# EAGLE design Son_of_Dark_Powersch (EAGLE 7.3.0)

## Sheet 1 of 5
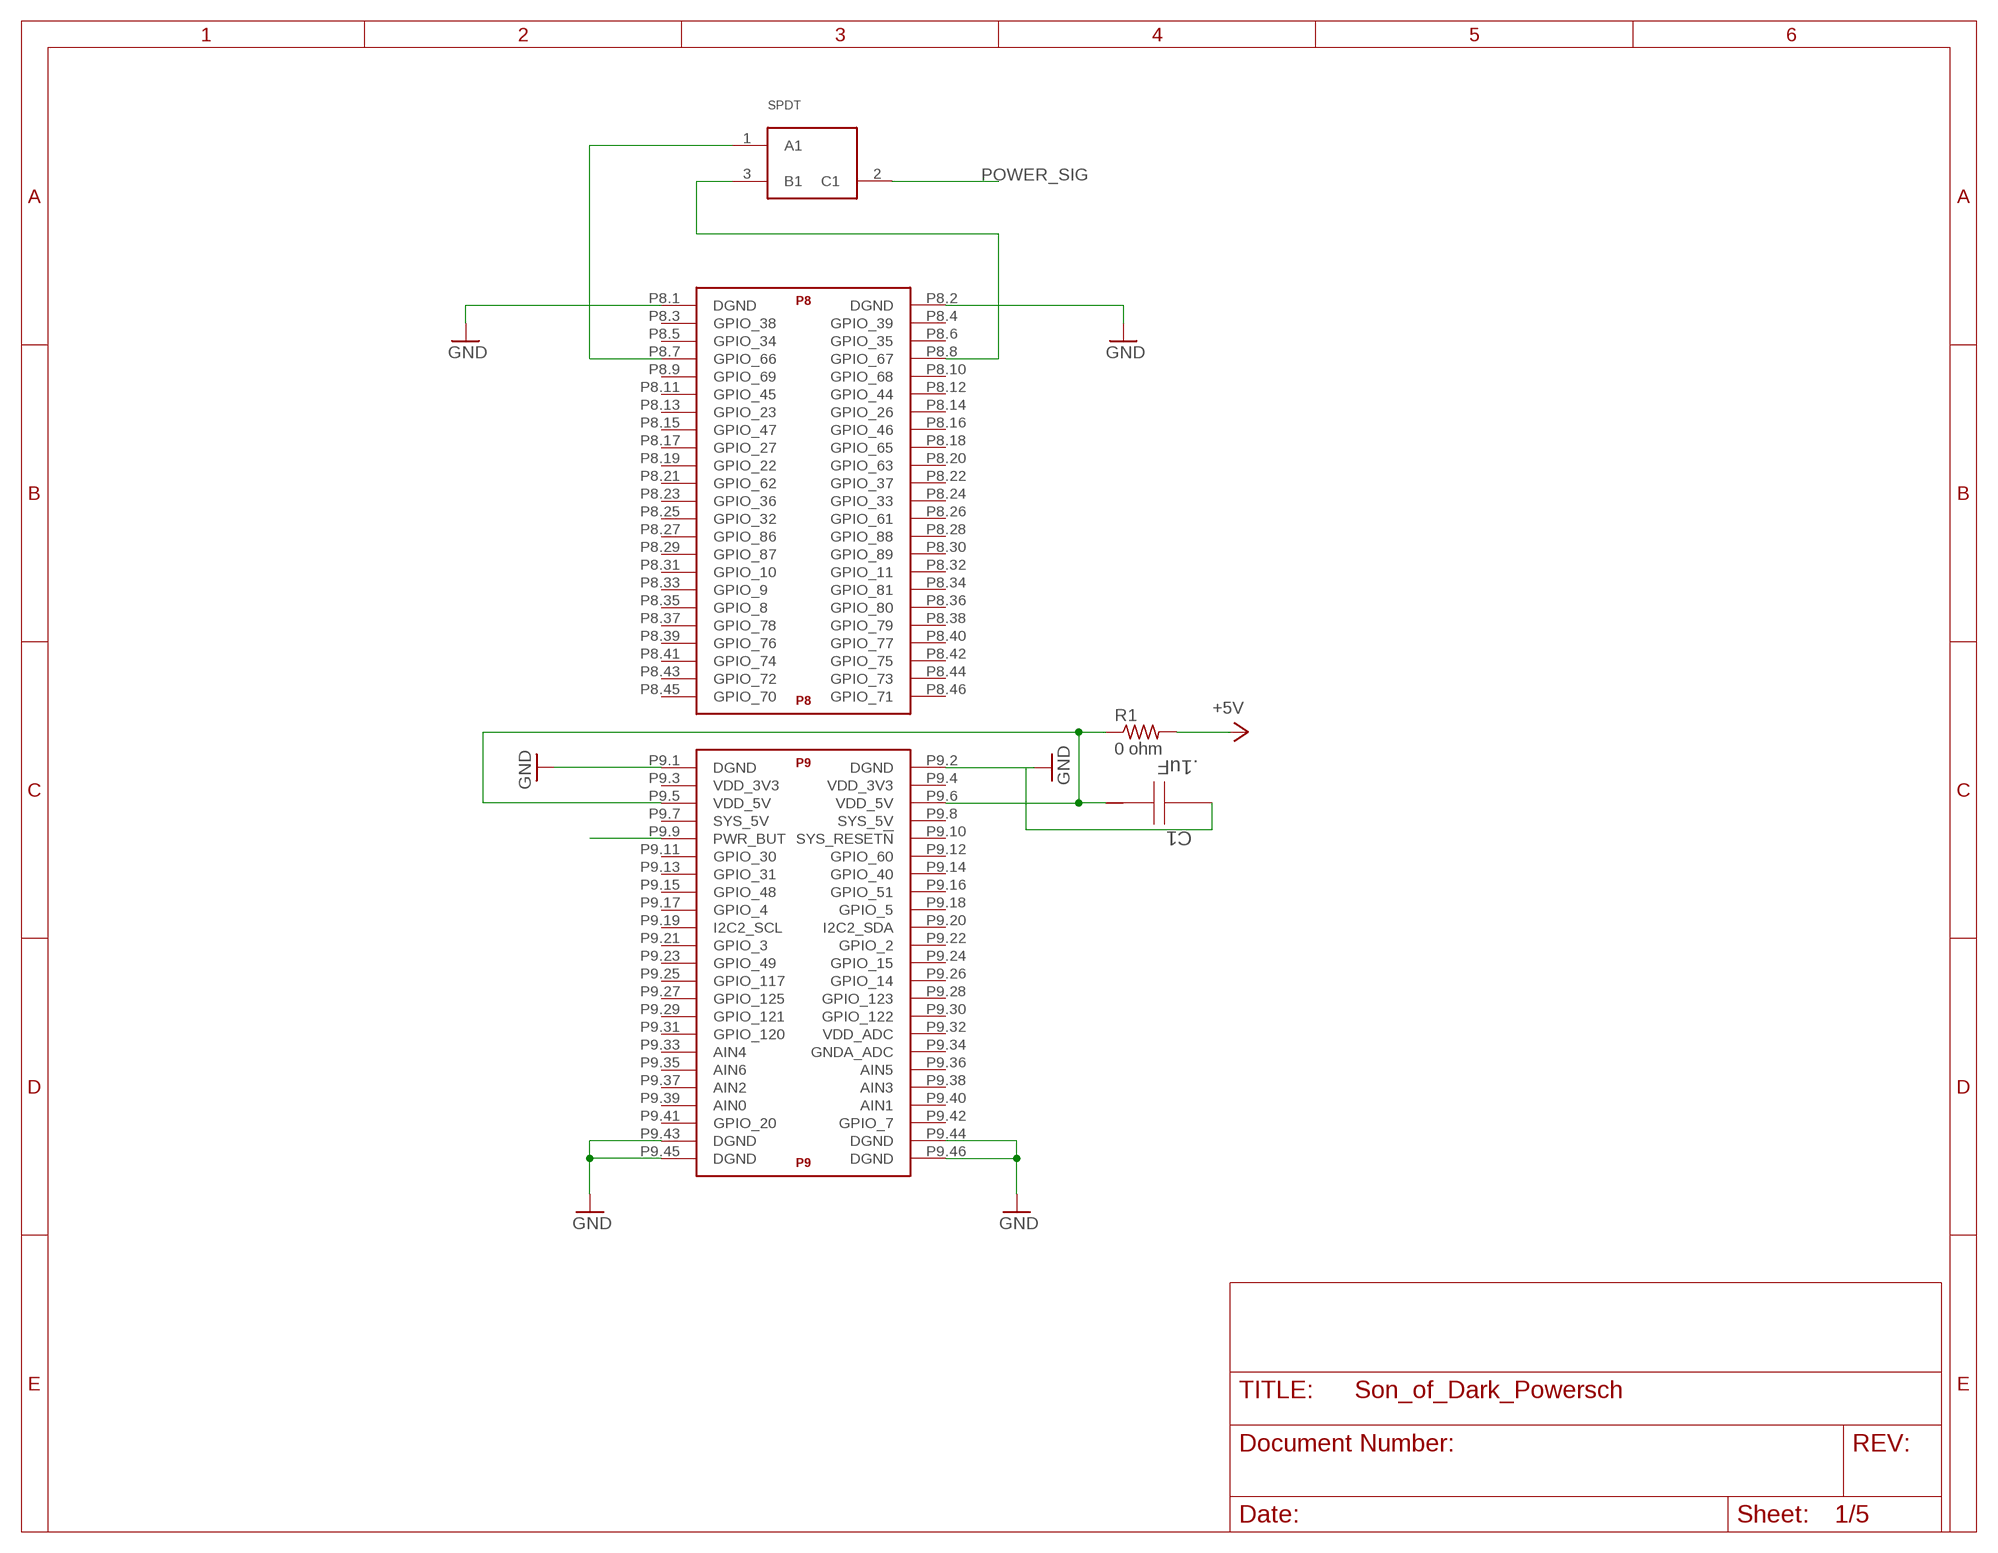
[diagram p0: schematic, sheet 1]

### Parts
C1  .1uF  C3216X5R1A106K  [1206]
R1  0 ohm  R-US_R1206  [R1206]
SPDT  SPDT_SWITCH  [SPDT]
U$1  BEAGLE_BONE_BLACK_CAPE  [BEAGLE_BONE_BLACK_CAPE]

### Nets
+5V: R1.2 ; also sheet 2,5
BB_PWR_SW: U$1.P9.9(P9:PWR_BUT) ; also sheet 5
GND: C1.2 U$1.P8.1(P8:DGND) U$1.P8.2(P8:DGND) U$1.P9.1(P9:DGND) U$1.P9.2(P9:DGND) U$1.P9.43(P9:DGND) U$1.P9.44(P9:DGND) U$1.P9.45(P9:DGND) U$1.P9.46(P9:DGND) ; also sheet 2,3,4,5
N$1: C1.1 R1.1 U$1.P9.5(P9:VDD_5V) U$1.P9.6(P9:VDD_5V)
N$12: SPDT.1(A1) U$1.P8.7(P8:GPIO_66)
N$13: SPDT.3(B1) U$1.P8.8(P8:GPIO_67)
POWER_SIG: SPDT.2(C1) ; also sheet 5
Unconnected: U$1.P8.3(P8:GPIO_38) U$1.P8.4(P8:GPIO_39) U$1.P8.5(P8:GPIO_34) U$1.P8.6(P8:GPIO_35) U$1.P8.9(P8:GPIO_69) U$1.P8.10(P8:GPIO_68) U$1.P8.11(P8:GPIO_45) U$1.P8.12(P8:GPIO_44) U$1.P8.13(P8:GPIO_23) U$1.P8.14(P8:GPIO_26) U$1.P8.15(P8:GPIO_47) U$1.P8.16(P8:GPIO_46) U$1.P8.17(P8:GPIO_27) U$1.P8.18(P8:GPIO_65) U$1.P8.19(P8:GPIO_22) U$1.P8.20(P8:GPIO_63) U$1.P8.21(P8:GPIO_62) U$1.P8.22(P8:GPIO_37) U$1.P8.23(P8:GPIO_36) U$1.P8.24(P8:GPIO_33) U$1.P8.25(P8:GPIO_32) U$1.P8.26(P8:GPIO_61) U$1.P8.27(P8:GPIO_86) U$1.P8.28(P8:GPIO_88) U$1.P8.29(P8:GPIO_87) U$1.P8.30(P8:GPIO_89) U$1.P8.31(P8:GPIO_10) U$1.P8.32(P8:GPIO_11) U$1.P8.33(P8:GPIO_9) U$1.P8.34(P8:GPIO_81) U$1.P8.35(P8:GPIO_8) U$1.P8.36(P8:GPIO_80) U$1.P8.37(P8:GPIO_78) U$1.P8.38(P8:GPIO_79) U$1.P8.39(P8:GPIO_76) U$1.P8.40(P8:GPIO_77) U$1.P8.41(P8:GPIO_74) U$1.P8.42(P8:GPIO_75) U$1.P8.43(P8:GPIO_72) U$1.P8.44(P8:GPIO_73) U$1.P8.45(P8:GPIO_70) U$1.P8.46(P8:GPIO_71) U$1.P9.3(P9:VDD_3V3) U$1.P9.4(P9:VDD_3V3) U$1.P9.7(P9:SYS_5V) U$1.P9.8(P9:SYS_5V) U$1.P9.10(P9:SYS_RESET!N) U$1.P9.11(P9:GPIO_30) U$1.P9.12(P9:GPIO_60) U$1.P9.13(P9:GPIO_31) U$1.P9.14(P9:GPIO_40) U$1.P9.15(P9:GPIO_48) U$1.P9.16(P9:GPIO_51) U$1.P9.17(P9:GPIO_4) U$1.P9.18(P9:GPIO_5) U$1.P9.19(P9:I2C2_SCL) U$1.P9.20(P9:I2C2_SDA) U$1.P9.21(P9:GPIO_3) U$1.P9.22(P9:GPIO_2) U$1.P9.23(P9:GPIO_49) U$1.P9.24(P9:GPIO_15) U$1.P9.25(P9:GPIO_117) U$1.P9.26(P9:GPIO_14) U$1.P9.27(P9:GPIO_125) U$1.P9.28(P9:GPIO_123) U$1.P9.29(P9:GPIO_121) U$1.P9.30(P9:GPIO_122) U$1.P9.31(P9:GPIO_120) U$1.P9.32(P9:VDD_ADC) U$1.P9.33(P9:AIN4) U$1.P9.34(P9:GNDA_ADC) U$1.P9.35(P9:AIN6) U$1.P9.36(P9:AIN5) U$1.P9.37(P9:AIN2) U$1.P9.38(P9:AIN3) U$1.P9.39(P9:AIN0) U$1.P9.40(P9:AIN1) U$1.P9.41(P9:GPIO_20) U$1.P9.42(P9:GPIO_7)

## Sheet 2 of 5
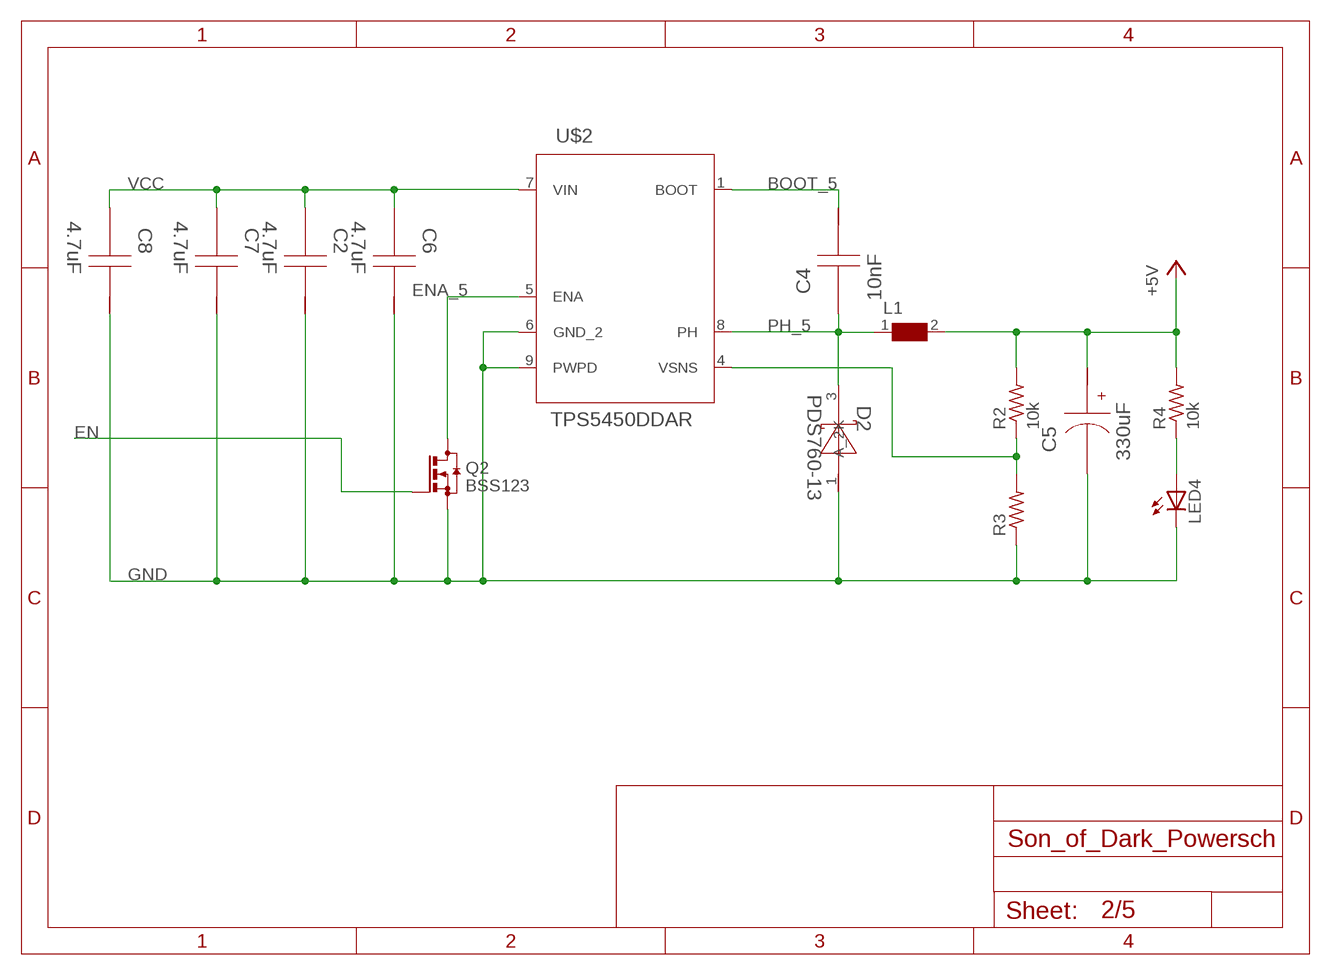
[diagram p1: schematic, sheet 2]

### Parts
C2  4.7uF  GRM31CR71H475KA12L  [1206]
C4  10nF  C0805C103K5RACTU  [0805]
C5  330uF  10SVP330MX  [SM_RADIAL_10AMM]
C6  4.7uF  GRM31CR71H475KA12L  [1206]
C7  4.7uF  GRM31CR71H475KA12L  [1206]
C8  4.7uF  GRM31CR71H475KA12L  [1206]
D2  PDS760-13  [POWERDI5]
L1  WE-HCC-7443331000_1090  [WE-HCC_1090]
LED4  LEDSML1206  [SML1206]
Q2  BSS123  [SOT23]
R2  10k  R-US_R1206  [R1206]
R3  R-US_R1206  [R1206]
R4  10k  R-US_R1206  [R1206]
U$2  TPS5450DDAR  [R-PDSO-G8]

### Nets
+5V: C5.1(+) L1.2 R2.2 R4.2 ; also sheet 1,5
BOOT_5: C4.1 U$2.1(BOOT)
EN: Q2.1(G) ; also sheet 3,4,5
ENA_5: Q2.3(D) U$2.5(ENA)
GND: C2.1 C5.2(-) C6.1 C7.1 C8.1 D2.1(A_2) LED4.C Q2.2(S) R3.1 U$2.6(GND_2) U$2.9(PWPD) ; also sheet 1,3,4,5
N$2: LED4.A R4.1
PH_5: C4.2 D2.3(K) L1.1 U$2.8(PH)
VCC: C2.2 C6.2 C7.2 C8.2 U$2.7(VIN) ; also sheet 3,4,5
VSNS_5: R2.1 R3.2 U$2.4(VSNS)

## Sheet 3 of 5
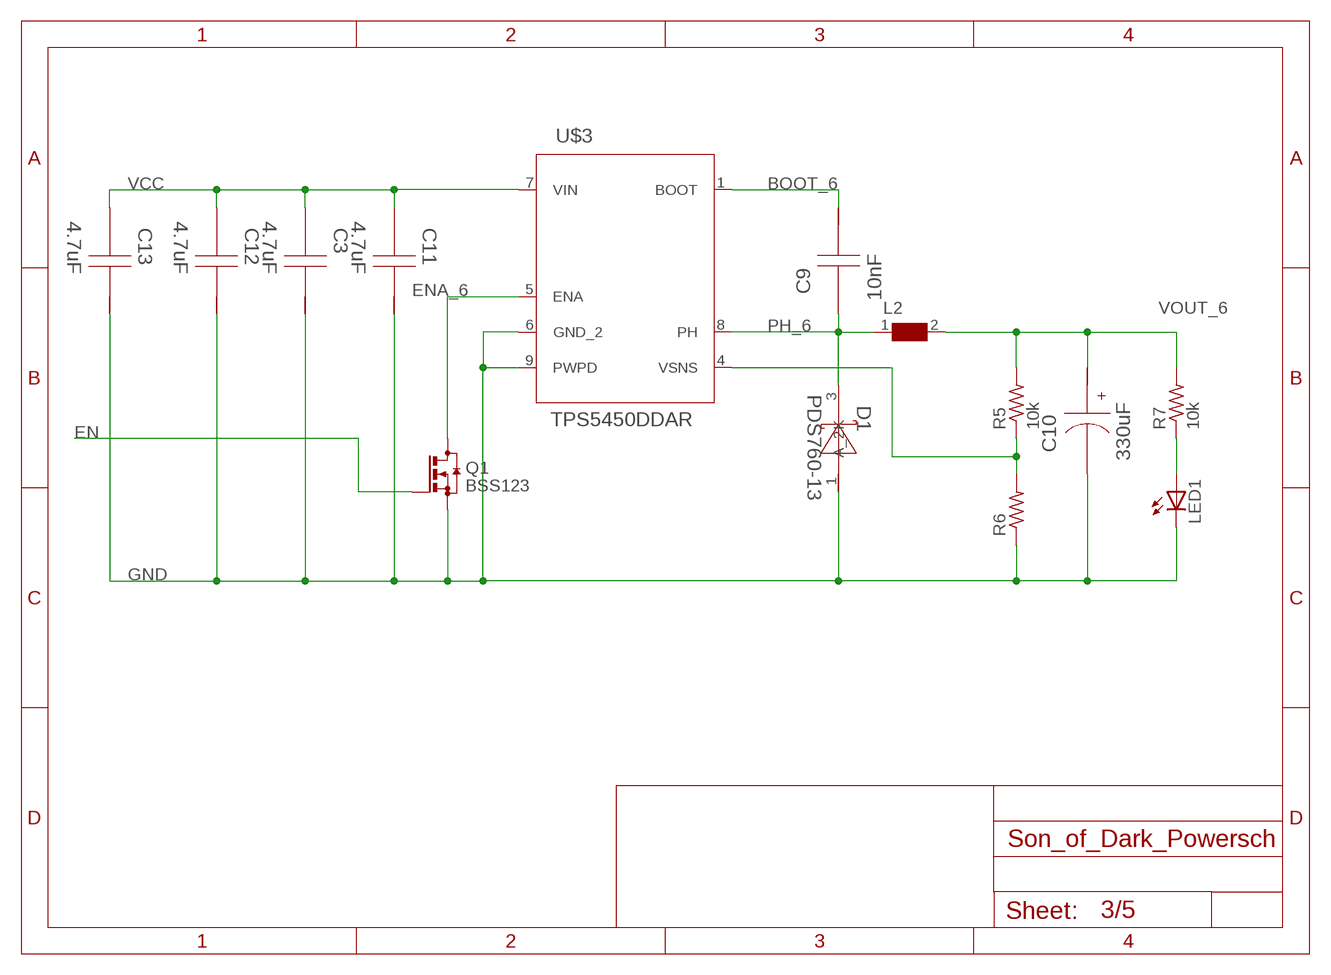
[diagram p2: schematic, sheet 3]

### Parts
C3  4.7uF  GRM31CR71H475KA12L  [1206]
C9  10nF  C0805C103K5RACTU  [0805]
C10  330uF  10SVP330MX  [SM_RADIAL_10AMM]
C11  4.7uF  GRM31CR71H475KA12L  [1206]
C12  4.7uF  GRM31CR71H475KA12L  [1206]
C13  4.7uF  GRM31CR71H475KA12L  [1206]
D1  PDS760-13  [POWERDI5]
L2  WE-HCC-7443331000_1090  [WE-HCC_1090]
LED1  LEDSML1206  [SML1206]
Q1  BSS123  [SOT23]
R5  10k  R-US_R1206  [R1206]
R6  R-US_R1206  [R1206]
R7  10k  R-US_R1206  [R1206]
U$3  TPS5450DDAR  [R-PDSO-G8]

### Nets
BOOT_6: C9.1 U$3.1(BOOT)
EN: Q1.1(G) ; also sheet 2,4,5
ENA_6: Q1.3(D) U$3.5(ENA)
GND: C3.1 C10.2(-) C11.1 C12.1 C13.1 D1.1(A_2) LED1.C Q1.2(S) R6.1 U$3.6(GND_2) U$3.9(PWPD) ; also sheet 1,2,4,5
N$3: LED1.A R7.1
PH_6: C9.2 D1.3(K) L2.1 U$3.8(PH)
VCC: C3.2 C11.2 C12.2 C13.2 U$3.7(VIN) ; also sheet 2,4,5
VOUT_6: C10.1(+) L2.2 R5.2 R7.2 ; also sheet 5
VSNS_6: R5.1 R6.2 U$3.4(VSNS)

## Sheet 4 of 5
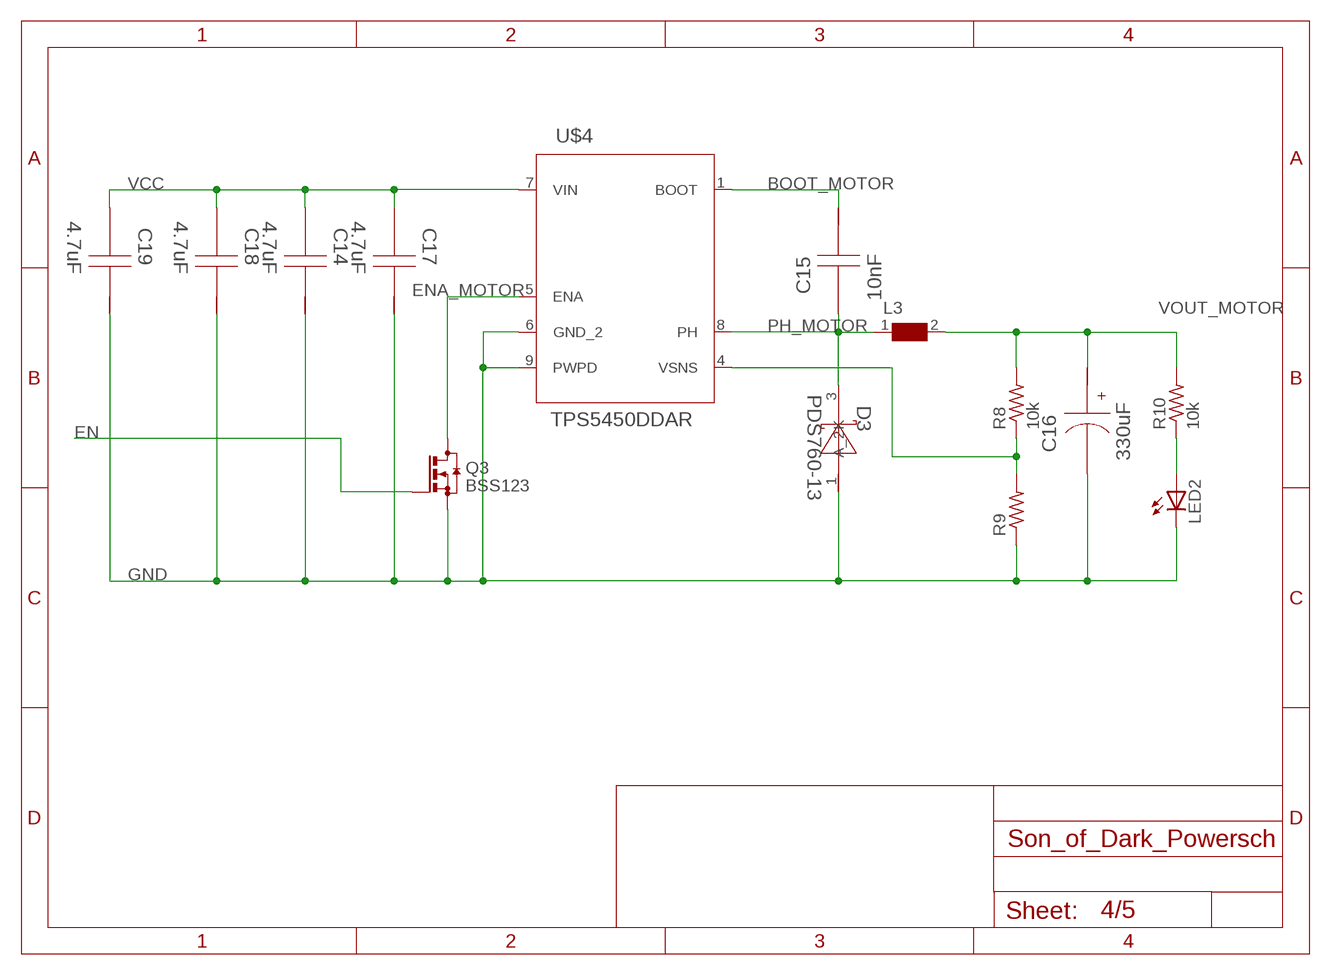
[diagram p3: schematic, sheet 4]

### Parts
C14  4.7uF  GRM31CR71H475KA12L  [1206]
C15  10nF  C0805C103K5RACTU  [0805]
C16  330uF  10SVP330MX  [SM_RADIAL_10AMM]
C17  4.7uF  GRM31CR71H475KA12L  [1206]
C18  4.7uF  GRM31CR71H475KA12L  [1206]
C19  4.7uF  GRM31CR71H475KA12L  [1206]
D3  PDS760-13  [POWERDI5]
L3  WE-HCC-7443331000_1090  [WE-HCC_1090]
LED2  LEDSML1206  [SML1206]
Q3  BSS123  [SOT23]
R8  10k  R-US_R1206  [R1206]
R9  R-US_R1206  [R1206]
R10  10k  R-US_R1206  [R1206]
U$4  TPS5450DDAR  [R-PDSO-G8]

### Nets
BOOT_MOTOR: C15.1 U$4.1(BOOT)
EN: Q3.1(G) ; also sheet 2,3,5
ENA_MOTOR: Q3.3(D) U$4.5(ENA)
GND: C14.1 C16.2(-) C17.1 C18.1 C19.1 D3.1(A_2) LED2.C Q3.2(S) R9.1 U$4.6(GND_2) U$4.9(PWPD) ; also sheet 1,2,3,5
N$4: LED2.A R10.1
PH_MOTOR: C15.2 D3.3(K) L3.1 U$4.8(PH)
VCC: C14.2 C17.2 C18.2 C19.2 U$4.7(VIN) ; also sheet 2,3,5
VOUT_MOTOR: C16.1(+) L3.2 R8.2 R10.2 ; also sheet 5
VSNS1_MOTOR: R8.1 R9.2 U$4.4(VSNS)

## Sheet 5 of 5
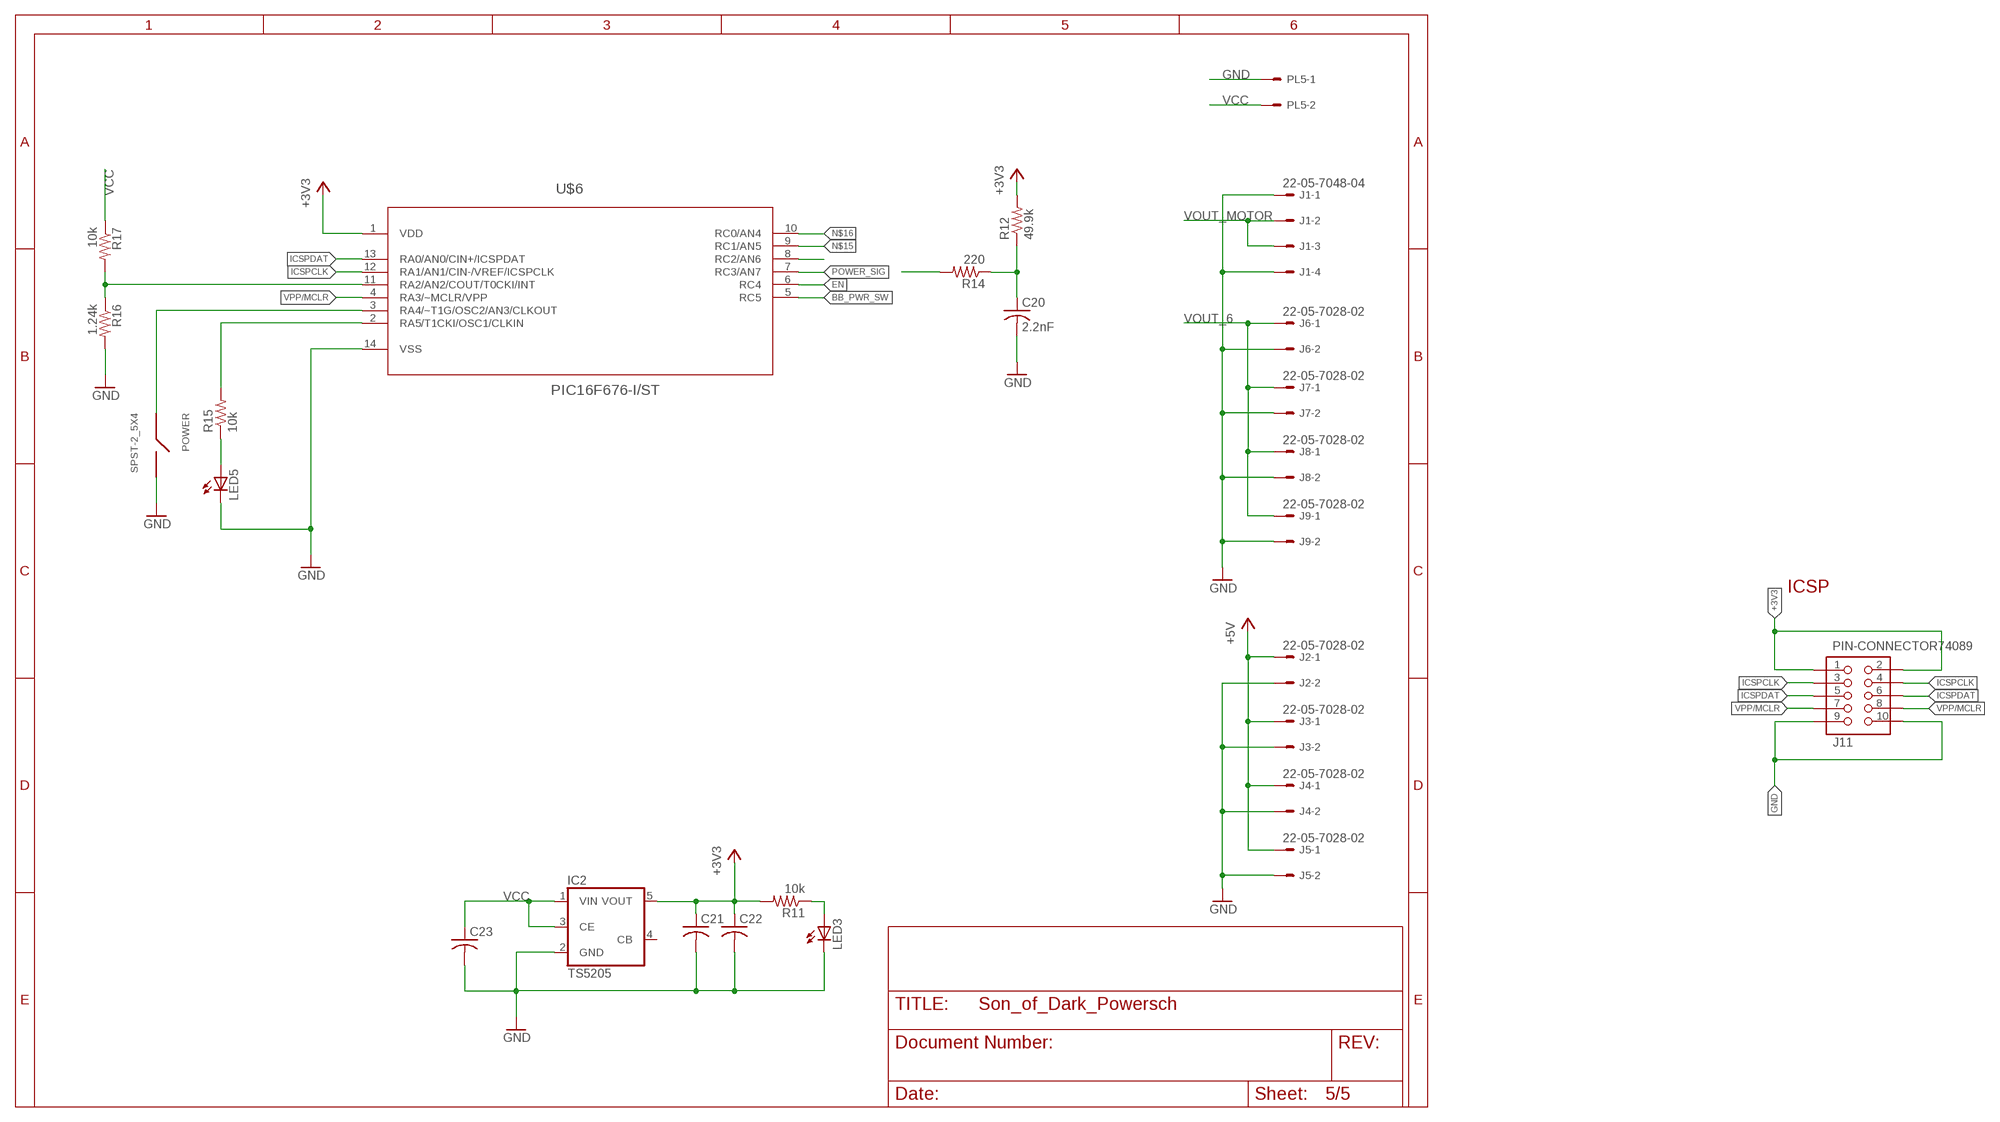
[diagram p4: schematic, sheet 5]

### Parts
C20  2.2nF  C-USC0603  [C0603]
C21  C-USC0603  [C0603]
C22  C-USC0603  [C0603]
C23  C-USC0603  [C0603]
IC2  TS5205  [SOT25]
J1  22-05-7048-04  [7395-04]
J2  22-05-7028-02  [7395-02]
J3  22-05-7028-02  [7395-02]
J4  22-05-7028-02  [7395-02]
J5  22-05-7028-02  [7395-02]
J6  22-05-7028-02  [7395-02]
J7  22-05-7028-02  [7395-02]
J8  22-05-7028-02  [7395-02]
J9  22-05-7028-02  [7395-02]
J11  PIN-CONNECTOR74089  [10-PIN-SMD]
LED3  LEDSML1206  [SML1206]
LED5  LEDSML1206  [SML1206]
PL5  555X-2H  [5569-2]
POWER  SPST-2_5X4  [SPST-TAC-4X2_5MM]
R11  10k  R-US_R1206  [R1206]
R12  49.9k  R-US_R0603  [R0603]
R14  220  R-US_R0603  [R0603]
R15  10k  R-US_R1206  [R1206]
R16  1.24k  R-US_R0603  [R0603]
R17  10k  R-US_R0603  [R0603]
U$6  PIC16F676-I/ST  [SOP65P640X120-14N]

### Nets
+3V3: C21.1 C22.1 IC2.5(VOUT) J11.1 J11.2 R11.2 R12.2 U$6.1(VDD)
+5V: J2.1 J3.1 J4.1 J5.1 ; also sheet 1,2
BB_PWR_SW: U$6.5(RC5) ; also sheet 1
EN: U$6.6(RC4) ; also sheet 2,3,4
GND: C20.2 C21.2 C22.2 C23.2 IC2.2(GND) J1.1 J1.4 J2.2 J3.2 J4.2 J5.2 J6.2 J7.2 J8.2 J9.2 J11.9 J11.10 LED3.C LED5.C PL5.1 POWER.P$2 R16.2 U$6.14(VSS) ; also sheet 1,2,3,4
ICSPCLK: J11.3 J11.4 U$6.12(RA1/AN1/CIN-/VREF/ICSPCLK)
ICSPDAT: J11.5 J11.6 U$6.13(RA0/AN0/CIN+/ICSPDAT)
N$5: U$6.8(RC2/AN6)
N$6: C20.1 R12.1 R14.1
N$7: LED3.A R11.1
N$8: R16.1 R17.2 U$6.11(RA2/AN2/COUT/T0CKI/INT)
N$9: R15.2 U$6.2(RA5/T1CKI/OSC1/CLKIN)
N$10: LED5.A R15.1
N$11: POWER.P$1 U$6.3(RA4/~T1G/OSC2/AN3/CLKOUT)
N$15: U$6.9(RC1/AN5)
N$16: U$6.10(RC0/AN4)
POWER_SIG: U$6.7(RC3/AN7) ; also sheet 1
VCC: C23.1 IC2.1(VIN) IC2.3(CE) PL5.2 R17.1 ; also sheet 2,3,4
VOUT_6: J6.1 J7.1 J8.1 J9.1 ; also sheet 3
VOUT_MOTOR: J1.2 J1.3 ; also sheet 4
VPP/MCLR: J11.7 J11.8 R14.2 U$6.4(RA3/~MCLR/VPP)
Unconnected: IC2.4(CB)

### Notes on the sheet
- ICSP

## Library data of the parts
C1 = 3-3_fixed:C3216X5R1A106K; CAP: 1.0E-5; DATASHEETURL: http://www.tdk.co.jp/tefe02/e3999%5Fc.pdf; ESR: 0.00306; IRMS: 0.0; MANUFACTURER_PART_NUMBER: C3216X5R1A106K; VDC: 10.0; VENDOR: TDK
C2 C3 C6-C8 C11-C14 C17-C19 = 5v:GRM31CR71H475KA12L; CAP: 4.7E-6; ESR: 0.0; IRMS: 0.0; MANUFACTURER_NAME: MuRata; MANUFACTURER_PART_NUMBER: GRM31CR71H475KA12L; VDC: 50.0; VENDOR: MuRata
C4 C9 C15 = 5v:C0805C103K5RACTU; CAP: 1.0E-8; ESR: 1.739; IRMS: 0.411; MANUFACTURER_NAME: Kemet; MANUFACTURER_PART_NUMBER: C0805C103K5RACTU; VDC: 50.0; VENDOR: Kemet
C5 C10 C16 = 5v:10SVP330MX; CAP: 3.3E-4; DATASHEETURL: http://www.edc.sanyo.com/english/pdf/oscon/E32.pdf; ESR: 0.025; IRMS: 3.7; MANUFACTURER_NAME: Panasonic; MANUFACTURER_PART_NUMBER: 10SVP330MX; VDC: 10.0; VENDOR: Panasonic
C20-C23 = rcl:C-US: CAPACITOR, American symbol
D1-D3 = 5v:PDS760-13; DATASHEETURL: www.diodes.com/datasheets/ds30477.pdf; IO: 7.0; MANUFACTURER_NAME: Diodes Inc.; MANUFACTURER_PART_NUMBER: PDS760-13; VENDOR: Diodes Inc.; VFATIO: 0.56; VRRM: 60.0
IC2 = v-reg:TS5205: 150mA Low Noise LDO Voltage Regulator with Enable TSC [Taiwan Semiconductor Company, Ltd] Source: http://www.taiwansemi.com .. 5205_0409c.pdf
J1 = con-molex:22-?-04: CONNECTOR wire to board 2.54 mm (.1 inch) pitch header; OC_FARNELL: unknown; OC_NEWARK: unknown
J2-J9 = con-molex:22-?-02: CONNECTOR wire to board 2.54 mm (.1 inch) pitch header; OC_FARNELL: 9731601; OC_NEWARK: unknown
J11 = Mother-Board-rev5:PIN-CONNECTOR
L1-L3 = WE-HCC:WE-HCC: SMD High Current Cube Inductor WE-HCC - magnetically shieled - current capability up to 27A - excellent saturation characteristics -- filter choke for DC/DC converter -- single and polyphase buck converter -- filter choke for motor electronics; MPN: 7443331000; OC_FARNELL: 1848254; OC_NEWARK: 13T9771; PACKAGE: 1090; SUPPLIER: Wuerth Elektronik
LED1-LED5 = led:LED: LED OSRAM: - CHIPLED LG R971, LG N971, LY N971, LG Q971, LY Q971, LO R971, LY R971 LH N974, LH R974 LS Q976, LO Q976, LY Q976 LO Q996 - Hyper CHIPLED LW Q18S LB Q993, LB Q99A, LB R99A - SideLED LS A670, LO A670, LY A670, LG A670, LP A670 LB A673, LV A673, LT A673, LW A673 LH A674 LY A675 LS A676, LA A676, LO A676, LY A676, LW A676 LS A679, LY A679, LG A679 - Hyper Micro SIDELED® LS Y876, LA Y876, LO Y876, LY Y876 LT Y87S - SmartLED LW L88C, LW L88S LB L89C, LB L89S, LG L890 LS L89K, LO L89K, LY L89K LS L896, LA L896, LO L896, LY L896 - TOPLED LS T670, LO T670, LY T670, LG T670, LP T670 LSG T670, LSP T670, LSY T670, LOP T670, LYG T670 LG T671, LOG T671, LSG T671 LB T673, LV T673, LT T673, LW T673 LH T674 LS T676, LA T676, LO T676, LY T676, LB T676, LH T676, LSB T676, LW T676 LB T67C, LV T67C, LT T67C, LS T67K, LO T67K, LY T67K, LW E67C LS E67B, LA E67B, LO E67B, LY E67B, LB E67C, LV E67C, LT E67C LW T67C LS T679, LY T679, LG T679 LS T770, LO T770, LY T770, LG T770, LP T770 LB T773, LV T773, LT T773, LW T773 LH T774 LS E675, LA E675, LY E675, LS T675 LS T776, LA T776, LO T776, LY T776, LB T776 LHGB T686 LT T68C, LB T68C - Hyper Mini TOPLED® LB M676 - Mini TOPLED Santana® LG M470 LS M47K, LO M47K, LY M47K Source: http://www.osram.convergy.de LUXEON: - LUMILED® LXK2-PW12-R00, LXK2-PW12-S00, LXK2-PW14-U00, LXK2-PW14-V00 LXK2-PM12-R00, LXK2-PM12-S00, LXK2-PM14-U00 LXK2-PE12-Q00, LXK2-PE12-R00, LXK2-PE12-S00, LXK2-PE14-T00, LXK2-PE14-U00 LXK2-PB12-K00, LXK2-PB12-L00, LXK2-PB12-M00, LXK2-PB14-N00, LXK2-PB14-P00, LXK2-PB14-Q00 LXK2-PR12-L00, LXK2-PR12-M00, LXK2-PR14-Q00, LXK2-PR14-R00 LXK2-PD12-Q00, LXK2-PD12-R00, LXK2-PD12-S00 LXK2-PH12-R00, LXK2-PH12-S00 LXK2-PL12-P00, LXK2-PL12-Q00, LXK2-PL12-R00 Source: www.luxeon.com KINGBRIGHT: KA-3528ASYC Source: www.kingbright.com
PL5 = con-molex-2:555X-2: Mini FIT connector 2 way
POWER = ultrasonic_mount:SPST-2_5X4
Q1-Q3 = transistor-small-signal:BSS123: N-CHANNEL MOS FET
R1-R12 R14-R17 = rcl:R-US_: RESISTOR, American symbol
SPDT = range_cape:SPDT_SWITCH
U$1 = SparkFun-Boards:BEAGLE_BONE_BLACK_CAPE
U$2-U$4 = 5v:TPS5450DDAR; DATASHEETURL: http://www.ti.com/product/tps5450; FREQUENCY: 500000.0; IMAX: 5.0; MANUFACTURER_NAME: Texas Instruments; MANUFACTURER_PART_NUMBER: TPS5450DDA; MKTG_PACKAGE: TPS5450; NSID: TPS5450DDAR; PACKAGE: TPS5450; VENDOR: Texas Instruments
U$6 = Microchip_By_element14_Batch_1:PIC16F676-I/ST: 8 bit CMOS Microcontrollers; DESCRIPTION: 8 bit CMOS Microcontrollers; MPN: PIC16F676-I/ST; OC_FARNELL: 9760539; OC_NEWARK: 92C4553; PACKAGE: TSSOP-14; SUPPLIER: Microchip

## Board
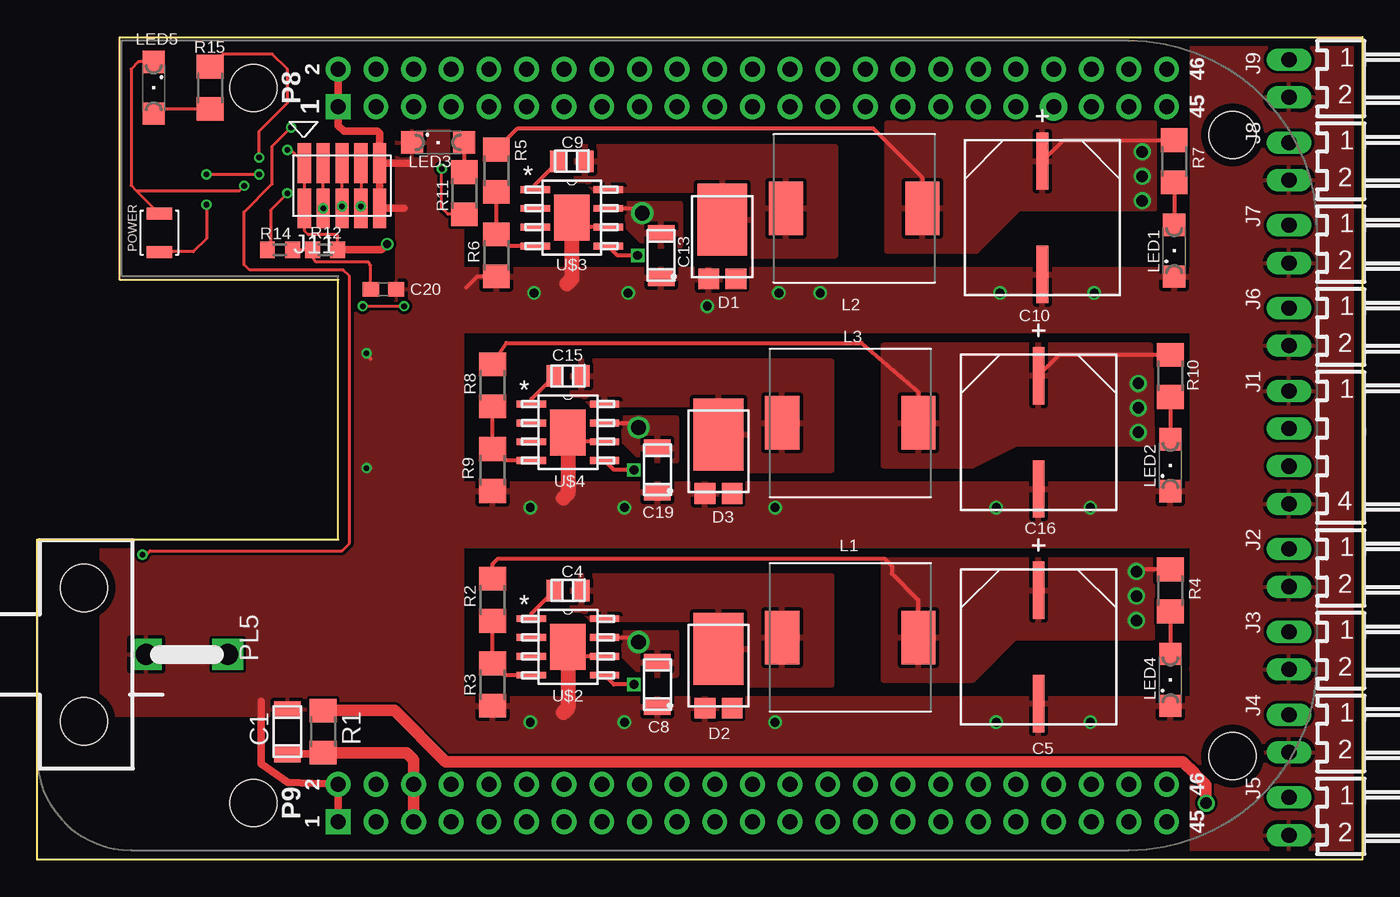
[diagram p5: board, top side]
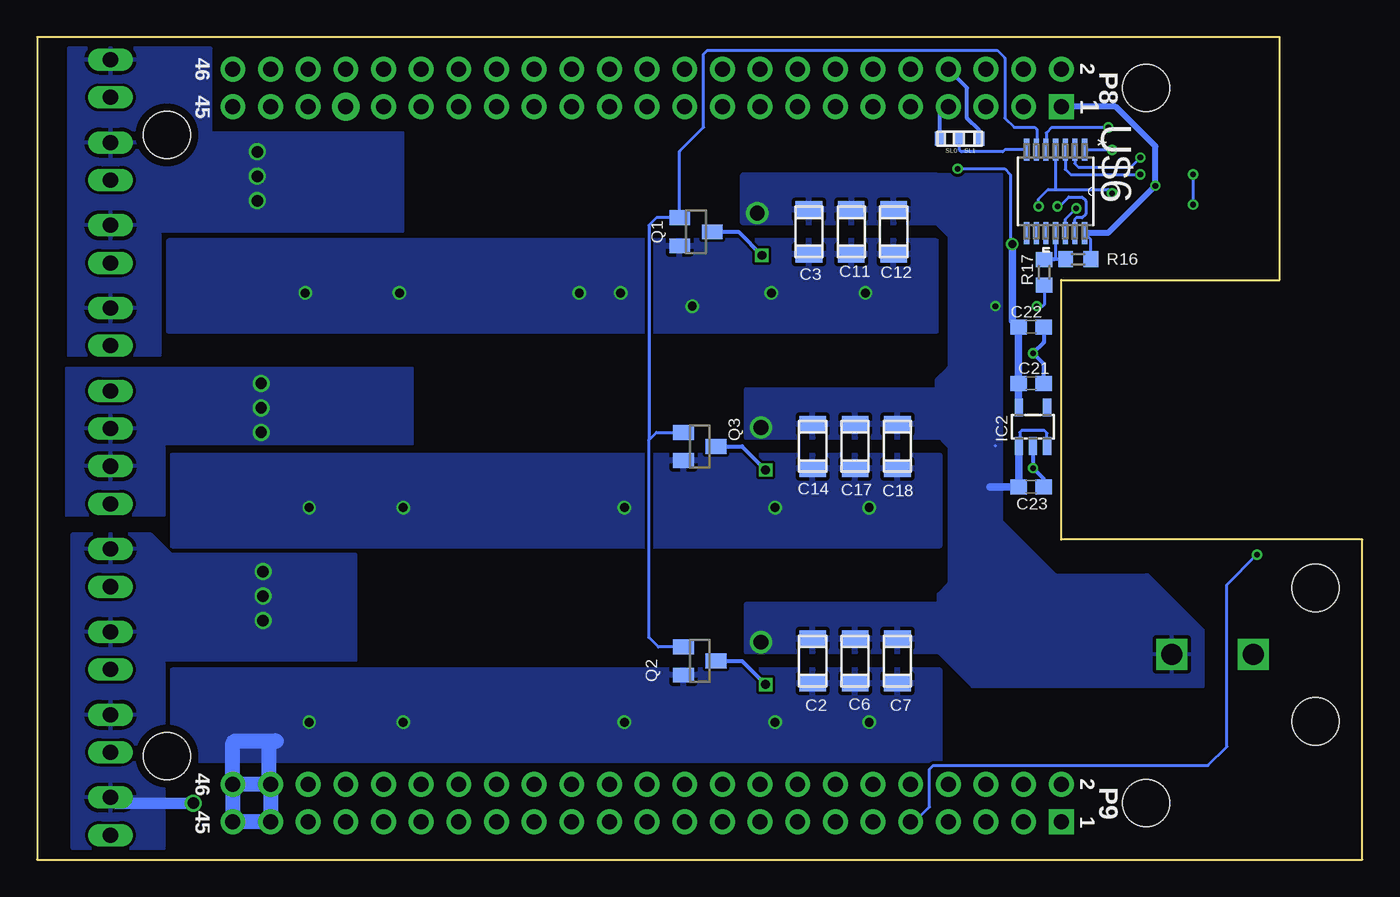
[diagram p6: board, bottom side, seen from below]

Size 89.41 x 55.5 mm. Coordinates in mm from the lower left corner, seen from the top.
Outline: 89.41,55.5 89.41,0 0,0 0,21.59 20.32,21.59 20.32,39.12 5.59,39.12 5.59,55.5 89.41,55.5
Copper layers (1*16): Top 0.035mm / dielectric 1.5mm / Bottom 0.035mm
Design rules "EagleRules-2-Layer": minimum track width 7mil, minimum drill 12mil, track to track 7mil, track to pad 7mil, pad to pad 7mil, via to via 7mil, smd to smd 0mil, copper to edge 20mil, drill to drill 10mil, minimum pad ring 10mil, minimum via ring 6mil, stop-mask expansion 2mil, vias tented up to drill 25mil, thermal gap 10mil

### Footprints (pad centres in the part's own frame; a part is rotated, then mirrored left to right if it is on the bottom)
1206 = smd 1.118 x 1.803: 1 -1.499,0; 2 1.499,0
0805 = smd 1.118 x 1.448: 1 -0.902,0; 2 0.902,0
SM_RADIAL_10AMM = smd 3.861 x 0.787: 1 -3.823,0; 2 3.823,0
C0603 = smd 1.1 x 1: 1 -0.85,0; 2 0.85,0
POWERDI5 = smd 1.397 x 1.397: 1 -0.92,-2.857; 2 0.92,-2.857 | smd 3.353 x 4.851: 3 0,1.13
SOT25 = smd 0.55 x 1.2: 1 -0.95,-1.3; 2 0,-1.3; 3 0.95,-1.3; 4 0.95,1.3; 5 -0.95,1.3
7395-04 = drill 1.016 long: 1 3.81,0; 2 1.27,0; 3 -1.27,0; 4 -3.81,0
7395-02 = drill 1.016 long: 1 1.27,0; 2 -1.27,0
10-PIN-SMD = smd 0.889 x 2.667: 1 -2.54,1.524; 2 -2.54,-1.524; 3 -1.27,1.524; 4 -1.27,-1.524; 5 0,1.524; 6 0,-1.524; 7 1.27,1.524; 8 1.27,-1.524; 9 2.54,1.524; 10 2.54,-1.524
WE-HCC_1090 = smd 2.3 x 3.6: 1 -4.6,0; 2 4.6,0
SML1206 = smd 1.5 x 1.5: A 1.75,0; C -1.75,0
5569-2 = drill 1.4 square: 1 0,0; 2 0,5.5 | hole 3.2: 4.5,-4.2; -4.5,-4.2
SPST-TAC-4X2_5MM = smd 0.8 x 1.7: P$1 -1.3,0; P$2 1.3,0
SOT23 = smd 1 x 1.4: 1 -0.95,-1.1; 2 0.95,-1.1; 3 0,1.1
R1206 = smd 1.6 x 1.803: 1 -1.422,0; 2 1.422,0
R0603 = smd 1 x 1.1: 1 -0.85,0; 2 0.85,0
SPDT = smd 0.66 x 0.965: 1 -0.699,0; 2 0.572,0; 3 1.968,0
BEAGLE_BONE_BLACK_CAPE = drill 1.016 pad 1.676 square: P8.1 20.32,50.165; P9.1 20.32,1.905 | drill 1.016 pad 1.676: P8.2 20.32,52.705; P8.3 22.86,50.165; P8.4 22.86,52.705; P8.5 25.4,50.165; P8.6 25.4,52.705; P8.7 27.94,50.165; P8.8 27.94,52.705; P8.9 30.48,50.165; P8.10 30.48,52.705; P8.11 33.02,50.165; P8.12 33.02,52.705; P8.13 35.56,50.165; P8.14 35.56,52.705; P8.15 38.1,50.165; P8.16 38.1,52.705; P8.17 40.64,50.165; P8.18 40.64,52.705; P8.19 43.18,50.165; P8.20 43.18,52.705; P8.21 45.72,50.165; P8.22 45.72,52.705; P8.23 48.26,50.165; P8.24 48.26,52.705; P8.25 50.8,50.165; P8.26 50.8,52.705; P8.27 53.34,50.165; P8.28 53.34,52.705; P8.29 55.88,50.165; P8.30 55.88,52.705; P8.31 58.42,50.165; P8.32 58.42,52.705; P8.33 60.96,50.165; P8.34 60.96,52.705; P8.35 63.5,50.165; P8.36 63.5,52.705; P8.37 66.04,50.165; P8.38 66.04,52.705; P8.40 68.58,52.705; P8.41 71.12,50.165; P8.42 71.12,52.705; P8.43 73.66,50.165; P8.44 73.66,52.705; P8.45 76.2,50.165; P8.46 76.2,52.705; P9.2 20.32,4.445; P9.3 22.86,1.905; P9.4 22.86,4.445; P9.5 25.4,1.905; P9.6 25.4,4.445; P9.7 27.94,1.905; P9.8 27.94,4.445; P9.9 30.48,1.905; P9.10 30.48,4.445; P9.11 33.02,1.905; P9.12 33.02,4.445; P9.13 35.56,1.905; P9.14 35.56,4.445; P9.15 38.1,1.905; P9.16 38.1,4.445; P9.17 40.64,1.905; P9.18 40.64,4.445; P9.19 43.18,1.905; P9.20 43.18,4.445; P9.21 45.72,1.905; P9.22 45.72,4.445; P9.23 48.26,1.905; P9.24 48.26,4.445; P9.25 50.8,1.905; P9.26 50.8,4.445; P9.27 53.34,1.905; P9.28 53.34,4.445; P9.29 55.88,1.905; P9.30 55.88,4.445; P9.31 58.42,1.905; P9.32 58.42,4.445; P9.33 60.96,1.905; P9.34 60.96,4.445; P9.35 63.5,1.905; P9.36 63.5,4.445; P9.37 66.04,1.905; P9.38 66.04,4.445; P9.39 68.58,1.905; P9.40 68.58,4.445; P9.41 71.12,1.905; P9.42 71.12,4.445; P9.43 73.66,1.905; P9.44 73.66,4.445; P9.45 76.2,1.905; P9.46 76.2,4.445 | drill 1.016 pad 1.88: P8.39 68.58,50.165 | hole 3.175: 14.605,3.175; 80.645,6.35; 80.645,48.26; 14.605,51.435
R-PDSO-G8 = smd 1.981 x 0.457: 1 -2.464,1.905; 2 -2.464,0.635; 3 -2.464,-0.635; 4 -2.464,-1.905; 5 2.464,-1.905; 6 2.464,-0.635; 7 2.464,0.635; 8 2.464,1.905 | smd 2.388 x 3.099: 9 0,0
SOP65P640X120-14N = smd 1.473 x 0.356: 1 -2.819,1.956; 2 -2.819,1.295; 3 -2.819,0.66; 4 -2.819,0; 5 -2.819,-0.66; 6 -2.819,-1.295; 7 -2.819,-1.956; 8 2.819,-1.956; 9 2.819,-1.295; 10 2.819,-0.66; 11 2.819,0; 12 2.819,0.66; 13 2.819,1.295; 14 2.819,1.956

### Placement (x,y rotation side)
C1  16.89,8.64 90 top
C2  37.08,13.4 90 bottom
C3  37.34,42.35 90 bottom
C4  35.81,18.16 0 top
C5  67.56,14.35 270 top
C6  34.23,13.4 90 bottom
C7  31.37,13.4 90 bottom
C8  41.85,11.81 90 top
C9  36.07,47.12 0 top
C10  67.82,43.31 270 top
C11  34.48,42.35 90 bottom
C12  31.62,42.35 90 bottom
C13  42.1,40.77 90 top
C14  37.08,27.88 90 bottom
C15  35.81,32.64 0 top
C16  67.56,28.83 270 top
C17  34.23,27.88 90 bottom
C18  31.37,27.88 90 bottom
C19  41.85,26.29 90 top
C20  23.37,38.48 0 top
C21  22.35,32.13 0 bottom
C22  22.35,35.94 0 bottom
C23  22.35,25.15 0 bottom
D1  46.23,42.04 0 top
D2  45.97,13.08 0 top
D3  45.97,27.56 0 top
IC2  22.23,29.21 0 bottom
J1  84.45,27.81 90 top
J2  84.45,19.69 90 top
J3  84.45,14.1 90 top
J4  84.45,8.51 90 top
J5  84.45,2.92 90 top
J6  84.45,35.94 90 top
J7  84.45,41.53 90 top
J8  84.45,47.12 90 top
J9  84.45,52.7 90 top
J11  20.57,45.47 0 top
L1  54.86,14.99 0 top
L2  55.12,43.94 0 top
L3  54.86,29.46 0 top
LED1  76.71,41.08 90 top
LED2  76.45,26.61 90 top
LED3  27.05,48.39 0 top
LED4  76.45,12.13 90 top
LED5  7.87,52.07 270 top
PL5  7.37,13.84 270 top
POWER  8.26,42.29 90 top
Q1  44.96,42.35 270 bottom
Q2  44.7,13.4 270 bottom
Q3  44.7,27.88 270 bottom
R1  19.3,8.64 90 top
R2  30.73,17.53 90 top
R3  30.73,11.81 90 top
R4  76.45,18.16 90 top
R5  30.99,46.48 90 top
R6  30.99,40.77 90 top
R7  76.71,47.12 90 top
R8  30.73,32 90 top
R9  30.73,26.29 90 top
R10  76.45,32.64 90 top
R11  28.83,44.96 270 top
R12  19.43,41.15 0 top
R14  16.38,41.15 180 top
R15  11.68,52.07 90 top
R16  19.18,40.51 0 bottom
R17  21.46,39.62 90 bottom
SPDT  27.81,48.64 0 bottom
U$1  0,0.64 0 top
U$2  35.81,14.35 0 top
U$3  36.07,43.31 0 top
U$4  35.81,28.83 0 top
U$6  20.7,45.09 270 bottom

### Tracks (layer width: path | path; a pad name or v marks a point on that pad's centre or on a via)
+3V3  (via drill 0.38, 0.53)
  Top 0.203: J11.1 J11.2 18.03,42.42 18.29,42.16 20.19,42.16 20.28,42.08 R12.2 | J11.1 17.91,46.86 | R11.2 27.71,43.54 27.3,43.94 v27.3,46.61 | v16.89,47.88 17.14,47.88 J11.1
  Top 0.508: v23.62,41.53 23.24,41.15 R12.2
  Bottom 0.203: v27.3,46.61 24.13,46.61 23.75,46.23 23.75,41.66 v23.62,41.53 | U$6.1 16.92,47.9 v16.89,47.88
  Bottom 0.508: IC2.5 23.2,30.54 C21.1 C22.1 23.62,36.36 v23.62,41.53
+5V  (via drill 0.76)
  Top 0.254: R2.2 30.73,19.94 31.11,20.32 57.15,20.32 57.66,19.81 57.66,19.3 59.44,17.53 59.44,15.01 L1.2 | R4.2 74.83,19.58 v74.17,19.43
  Top 0.508: 78.09,5.81 78.09,5.77 | 78.83,3.85 v78.87,3.81
  Top 0.762: 78.09,5.81 77.3,6.6 27.56,6.6 24.11,10.06 R1.2 | 78.09,5.77 78.83,5.03 78.83,3.85
  Bottom 0.508: 84.33,4.32 J5.1 84.07,3.81
  Bottom 0.762: v78.87,3.81 84.07,3.81
  other vias: 74.17,17.78 74.17,16.13
  pour Top: 57.09,20.19 57.09,12.13 63.12,12.13 65.98,14.99 75.25,14.99 75.25,20.19
  pour Bottom: 87,0.76 87,21.97 81.79,21.97 80.39,20.57 67.94,20.57 67.94,13.46 80.9,13.46 80.9,0.76
BB_PWR_SW  (via drill 0.38)
  Top 0.203: v7.11,20.57 7.49,20.7 7.62,20.83 20.57,20.83 21.08,21.34 21.08,39.37 20.66,39.79 14.35,39.79 13.97,40.13 13.97,43.69 15.88,45.59 15.88,48.13 v17.14,49.4
  Bottom 0.203: U$1.P9.9 30.23,2.54 29.21,3.56 29.21,6.1 28.96,6.35 10.41,6.35 9.14,7.62 9.14,18.54 v7.11,20.57 | U$6.5 21.34,47.93 21.34,49.02 20.95,49.4 v17.14,49.4
BOOT_5
  Top 0.254: U$2.1 33.35,16.6 C4.1
BOOT_6
  Top 0.254: U$3.1 33.6,45.55 C9.1
BOOT_MOTOR
  Top 0.254: U$4.1 33.35,31.08 C15.1
EN
  Bottom 0.203: Q2.1 47.49,14.35 48.13,14.99 48.13,28.32 | 48.13,28.32 47.62,28.83 Q3.1 | 48.13,28.32 48.13,42.8 47.63,43.3 Q1.1 46.06,47.79 44.45,49.4 44.45,54.36 44.2,54.61 24.64,54.61 24.13,54.1 24.13,50.04 23.5,49.4 22.1,49.4 21.97,49.28 21.97,47.93 U$6.6
ENA_5  (via drill 0.6)
  Top 0.254: v40.26,11.81 38.91,11.81 U$2.5
  Bottom 0.254: Q2.3 41.85,13.4 v40.26,11.81
ENA_6  (via drill 0.6)
  Top 0.254: v40.51,40.77 39.17,40.77 U$3.5
  Bottom 0.254: Q1.3 42.1,42.35 v40.51,40.77
ENA_MOTOR  (via drill 0.6)
  Top 0.254: v40.26,26.29 38.91,26.29 U$4.5
  Bottom 0.254: Q3.3 41.85,27.88 v40.26,26.29
GND  (via drill 0.38, 0.6)
  Top 0.203: C20.2 24.38,38.48 | v13.97,45.47 13.62,45.11 6.73,45.11 | LED5.C 6.83,53.82 6.35,53.34 6.35,45.5 6.73,45.11 | 6.73,45.11 POWER.P$2
  Top 0.254: U$2.6 35.81,13.72 | U$3.6 36.07,42.67 | U$4.6 35.81,28.19 | 28.96,38.61 29.72,39.37 30.96,39.37 R6.1 | v22.23,26.42 22.48,26.42 | v22.23,34.16 22.35,34.16 22.35,33.91 22.48,33.78 | 7.24,13.72 PL5.1
  Top 0.508: U$1.P9.1 U$1.P9.2 16.89,5.21 15.11,6.48 15.11,10.67 | U$1.P8.2 U$1.P8.1 20.32,49.53 20.7,49.15 22.99,49.15 23.11,49.02 J11.9 | J11.9 J11.10 24.77,43.94 | J11.9 25.02,46.99
  Top 1.016: U$2.9 35.81,13.72 35.81,10.22 35.5,9.91 | U$3.9 36.07,42.67 36.07,39.18 35.75,38.86 | U$4.9 35.81,28.19 35.81,24.7 35.5,24.38
  Bottom 0.203: R16.2 18.33,41.85 U$6.14
  Bottom 0.254: C23.2 21.5,25.69 v22.23,26.42 IC2.2 | C22.2 21.5,34.89 v22.23,34.16 21.5,33.44 C21.2
  Bottom 0.406: U$6.14 18.72,42.29 17.14,42.29 v13.97,45.47 13.97,48.13 16.64,50.8 U$1.P8.1
  Bottom 1.016: U$1.P9.44 U$1.P9.43 U$1.P9.45 U$1.P9.46 | U$1.P9.44 U$1.P9.46 | U$1.P9.46 76.2,7.87 76.07,8 73.41,8 | 73.28,8 73.41,8 | 73.41,8 73.79,7.62 73.79,5.21 U$1.P9.44
  other vias: 33.27,9.27 39.62,9.27 49.78,9.27 64.71,9.27 71.06,9.27 33.53,38.23 39.88,38.23 50.04,38.23 64.96,38.23 71.31,38.23 33.27,23.75 39.62,23.75 49.78,23.75 64.71,23.75 71.06,23.75 52.83,38.23 45.21,37.34
  pour Bottom: 28.51,12.76 80.26,12.76 80.26,6.73 28.51,6.73
  pour Top: 28.51,10.86 80.26,10.86 80.26,6.73 28.51,6.73
  pour Bottom: 28.77,41.72 80.52,41.72 80.52,35.69 28.77,35.69
  pour Top: 28.77,39.81 80.52,39.81 80.52,35.69 28.77,35.69
  pour Bottom: 28.51,27.24 80.26,27.24 80.26,21.21 28.51,21.21
  pour Top: 28.51,25.34 80.26,25.34 80.26,21.21 28.51,21.21
  pour Top: 6.6,9.78 25.02,9.78 27.69,7.11 28.7,7.11 28.7,49.15 24.26,49.15 24.26,37.59 20.7,37.59 20.7,21.08 7.11,21.08 4.32,21.08 4.32,9.78
  pour Top: 77.85,12.83 77.85,0.64 89.53,0.64 89.53,55.24 77.85,55.24 77.85,12.95
ICSPCLK  (via drill 0.38)
  Top 0.203: J11.4 J11.3
  Bottom 0.203: U$6.12 20.04,43.2 J11.4
  other vias: 19.3,43.94
ICSPDAT  (via drill 0.38)
  Top 0.203: J11.5 v20.57,44.07 J11.6
  Bottom 0.203: v20.57,44.07 20.45,44.07 19.81,44.7 18.92,44.7 18.67,44.45 18.67,43.56 18.92,43.31 19.3,43.31 19.43,43.18 19.43,42.29 U$6.13
N$1
  Top 0.508: C1.1 19.23,7.14 R1.1
  Top 0.762: R1.1 24.92,7.21 25.4,6.73 U$1.P9.6 U$1.P9.5
N$2
  Top 0.254: R4.1 LED4.A
N$3
  Top 0.254: R7.1 LED1.A
N$4
  Top 0.254: R10.1 LED2.A
N$6
  Top 0.203: R14.1 R12.1 18.54,41.11 18.54,40.64 18.8,40.32 22.35,40.32 22.52,40.09 C20.1
N$7
  Top 0.254: R11.1 28.83,48.36 LED3.A
N$8
  Bottom 0.203: U$6.11 20.7,40.6 20.81,40.49
  Bottom 0.254: 20.05,40.54 R16.1 20.81,40.49 R17.2
N$9  (via drill 0.38)
  Top 0.203: v14.99,47.37 14.99,49.15 16.89,51.05 16.89,53.34 15.88,54.36 12.55,54.36 R15.2 12.29,54.1
  Bottom 0.203: U$6.2 19.41,46.96 19.18,46.74 15.62,46.74 v14.99,47.37
N$10
  Top 0.203: R15.1 7.87,50.65 LED5.A
N$11  (via drill 0.38)
  Top 0.203: v14.99,46.23 v11.43,46.23 | v11.43,44.2 11.43,41.91 10.54,41.02 8.29,41.02 POWER.P$1
  Bottom 0.203: U$6.3 20.04,46.58 19.68,46.23 v14.99,46.23 | v11.43,46.23 v11.43,44.2
N$12
  Bottom 0.254: SPDT.1 28.51,50.23 U$1.P8.7
N$13
  Bottom 0.254: SPDT.3 25.84,49.21 26.67,50.04 26.67,52.07 U$1.P8.8
PH_5
  pour Top: 36.13,19.11 36.13,16.89 36.77,16.89 37.4,16.26 44.07,16.26 47.24,11.81 53.59,11.81 53.59,19.11
PH_6
  pour Top: 36.39,48.07 36.39,45.85 37.02,45.85 37.66,45.21 44.32,45.21 47.5,40.77 53.85,40.77 53.85,48.07
PH_MOTOR
  pour Top: 36.13,33.59 36.13,31.37 36.77,31.37 37.4,30.73 44.07,30.73 47.24,26.29 53.59,26.29 53.59,33.59
POWER_SIG
  Bottom 0.203: U$6.7 24.11,47.9 24.26,47.75 27.05,47.75 27.18,47.88 27.18,48.58 SPDT.2
VCC  (via drill 0.38, 1)
  Top 0.203: v21.97,37.34 v24.77,37.34
  Top 0.254: U$2.7 40.26,14.99 v40.58,14.67 | U$3.7 40.51,43.94 v40.83,43.62 | U$4.7 40.26,29.46 v40.58,29.15
  Bottom 0.203: IC2.3 21.27,28.77 21.46,28.96 22.99,28.96 23.11,28.83 23.11,27.97 IC2.1 23.2,27.88 | 24.73,27.91 24.77,27.94 | R17.1 21.46,37.46 21.59,37.34 v21.97,37.34
  Bottom 0.508: 25.15,25.15 C23.1 23.18,25.17 IC2.1
  pour Bottom: 28.51,14.03 41.53,14.03 41.53,17.21 28.51,17.21
  pour Top: 39.62,13.72 39.62,15.3 43.12,15.3 43.12,12.45 40.89,12.45
  pour Bottom: 10.79,15.49 10.79,11.68 26.29,11.68 28.57,13.97 28.57,17.91 27.81,18.67 27.81,27.81 28.7,28.7 28.7,32.38 27.94,33.15 27.81,33.27 27.81,42.04 28.83,43.05 28.83,46.23 24.38,46.23 24.38,22.86 20.7,19.18 16,19.18 14.99,19.18 14.61,19.18 14.48,19.18
  pour Bottom: 28.77,42.99 41.78,42.99 41.78,46.16 28.77,46.16
  pour Top: 39.88,42.67 39.88,44.26 43.37,44.26 43.37,41.4 41.15,41.4
  pour Bottom: 28.51,28.51 41.53,28.51 41.53,31.69 28.51,31.69
  pour Top: 39.62,28.19 39.62,29.78 43.12,29.78 43.12,26.92 40.89,26.92
VOUT_6  (via drill 0.76)
  Top 0.254: R5.2 32.42,49.34 56.39,49.34 59.72,46.01 L2.2 | C10.1 69.23,48.54 R7.2
  other vias: 74.55,47.75 74.55,44.45 74.55,46.1
  pour Top: 57.34,49.66 57.34,41.08 63.37,41.08 66.23,43.94 75.37,43.94 75.37,49.66
  pour Bottom: 87.25,34.04 87.25,54.74 77.72,54.74 77.72,49.02 64.77,49.02 64.77,42.42 81.15,42.42 81.15,34.04
VOUT_MOTOR  (via drill 0.76)
  Top 0.254: R8.2 31.66,34.86 55.63,34.86 59.46,31.53 L3.2 | C16.1 68.97,34.06 R10.2
  other vias: 74.3,30.48 74.3,32.13 74.3,28.83
  pour Top: 57.09,34.67 57.09,26.61 63.12,26.61 66.1,28.07 75.25,28.07 75.12,34.67
  pour Bottom: 87.38,23.24 87.38,33.15 64.14,33.15 64.14,28.07 80.9,28.07 80.9,23.24
VPP/MCLR  (via drill 0.38)
  Top 0.203: J11.8 v21.84,44.07 J11.7 | R14.2 15.75,41.36 15.75,43.81 v16.89,44.96
  Bottom 0.203: v21.84,44.07 21.84,44.58 21.21,45.21 20.7,45.21 | 20.7,45.21 17.14,45.21 v16.89,44.96 | U$6.4 20.7,45.21
VSNS1_MOTOR
  Top 0.254: R8.1 R9.2 31.52,26.92 U$4.4
VSNS_5
  Top 0.254: R2.1 R3.2 31.52,12.45 U$2.4
VSNS_6
  Top 0.254: R5.1 R6.2 31.77,41.4 U$3.4